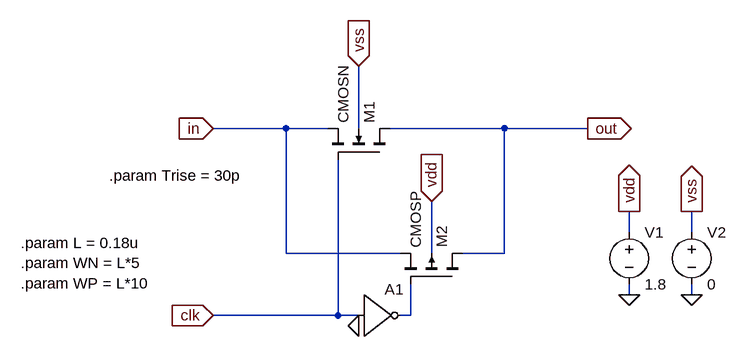
[diagram p0: schematic my_cmos_switch.asc]
my_cmos_switch.asc, the LTspice schematic file:
Version 4
SHEET 1 1120 680
WIRE -48 -272 -160 -272
WIRE 16 -272 -48 -272
WIRE 64 -272 64 -368
WIRE 288 -272 112 -272
WIRE 416 -272 288 -272
WIRE 480 -112 480 -144
WIRE 576 -112 576 -144
WIRE -48 -80 -48 -272
WIRE 128 -80 -48 -80
WIRE 176 -80 176 -160
WIRE 288 -80 288 -272
WIRE 288 -80 224 -80
WIRE 480 -16 480 -32
WIRE 576 -16 576 -32
WIRE 32 16 32 -224
WIRE 32 16 -160 16
WIRE 64 16 32 16
WIRE 144 16 144 -32
WIRE 144 16 128 16
FLAG 176 -160 vdd
IOPIN 176 -160 In
FLAG 64 -368 vss
IOPIN 64 -368 In
FLAG -160 -272 in
IOPIN -160 -272 In
FLAG -160 16 clk
IOPIN -160 16 In
FLAG 416 -272 out
IOPIN 416 -272 Out
FLAG 480 -16 0
FLAG 480 -144 vdd
IOPIN 480 -144 Out
FLAG 576 -16 0
FLAG 576 -144 vss
IOPIN 576 -144 Out
FLAG 64 32 0
SYMBOL nmos4 112 -224 M270
SYMATTR InstName M1
SYMATTR Value CMOSN
SYMATTR Value2 l={L} w={WN}
SYMBOL pmos4 224 -32 M270
SYMATTR InstName M2
SYMATTR Value CMOSP
SYMATTR Value2 l={L} w={WP}
SYMBOL voltage 480 -128 R0
WINDOW 123 0 0 Left 0
WINDOW 39 0 0 Left 0
SYMATTR InstName V1
SYMATTR Value 1.8
SYMBOL voltage 576 -128 R0
WINDOW 123 0 0 Left 0
WINDOW 39 0 0 Left 0
SYMATTR InstName V2
SYMATTR Value 0
SYMBOL Digital\\inv 64 -48 R0
SYMATTR InstName A1
SYMATTR SpiceLine Trise={Trise} Vhigh={Vhigh}
TEXT -456 -96 Left 2 !.param L = 0.18u\n.param WN = L*5\n.param WP = L*10
TEXT -320 -200 Left 2 !.param Trise = 30p

The netlist it stands for:
* my_cmos_switch.asc
M1 out clk in vss CMOSN l={L} w={WN}
M2 out N001 in vdd CMOSP l={L} w={WP}
V1 vdd 0 1.8
V2 vss 0 0
A1 clk 0 0 0 0 N001 0 0 BUF Trise={Trise} Vhigh={Vhigh}
.model NMOS NMOS
.model PMOS PMOS
.lib standard.mos
.param L = 0.18u
.param WN = L*5
.param WP = L*10
.param Trise = 30p
.backanno
.end